# Altium schematic sheet RS422.SchDoc
size 420 x 297 mm; SheetNumber: 25; SheetTotal: 32
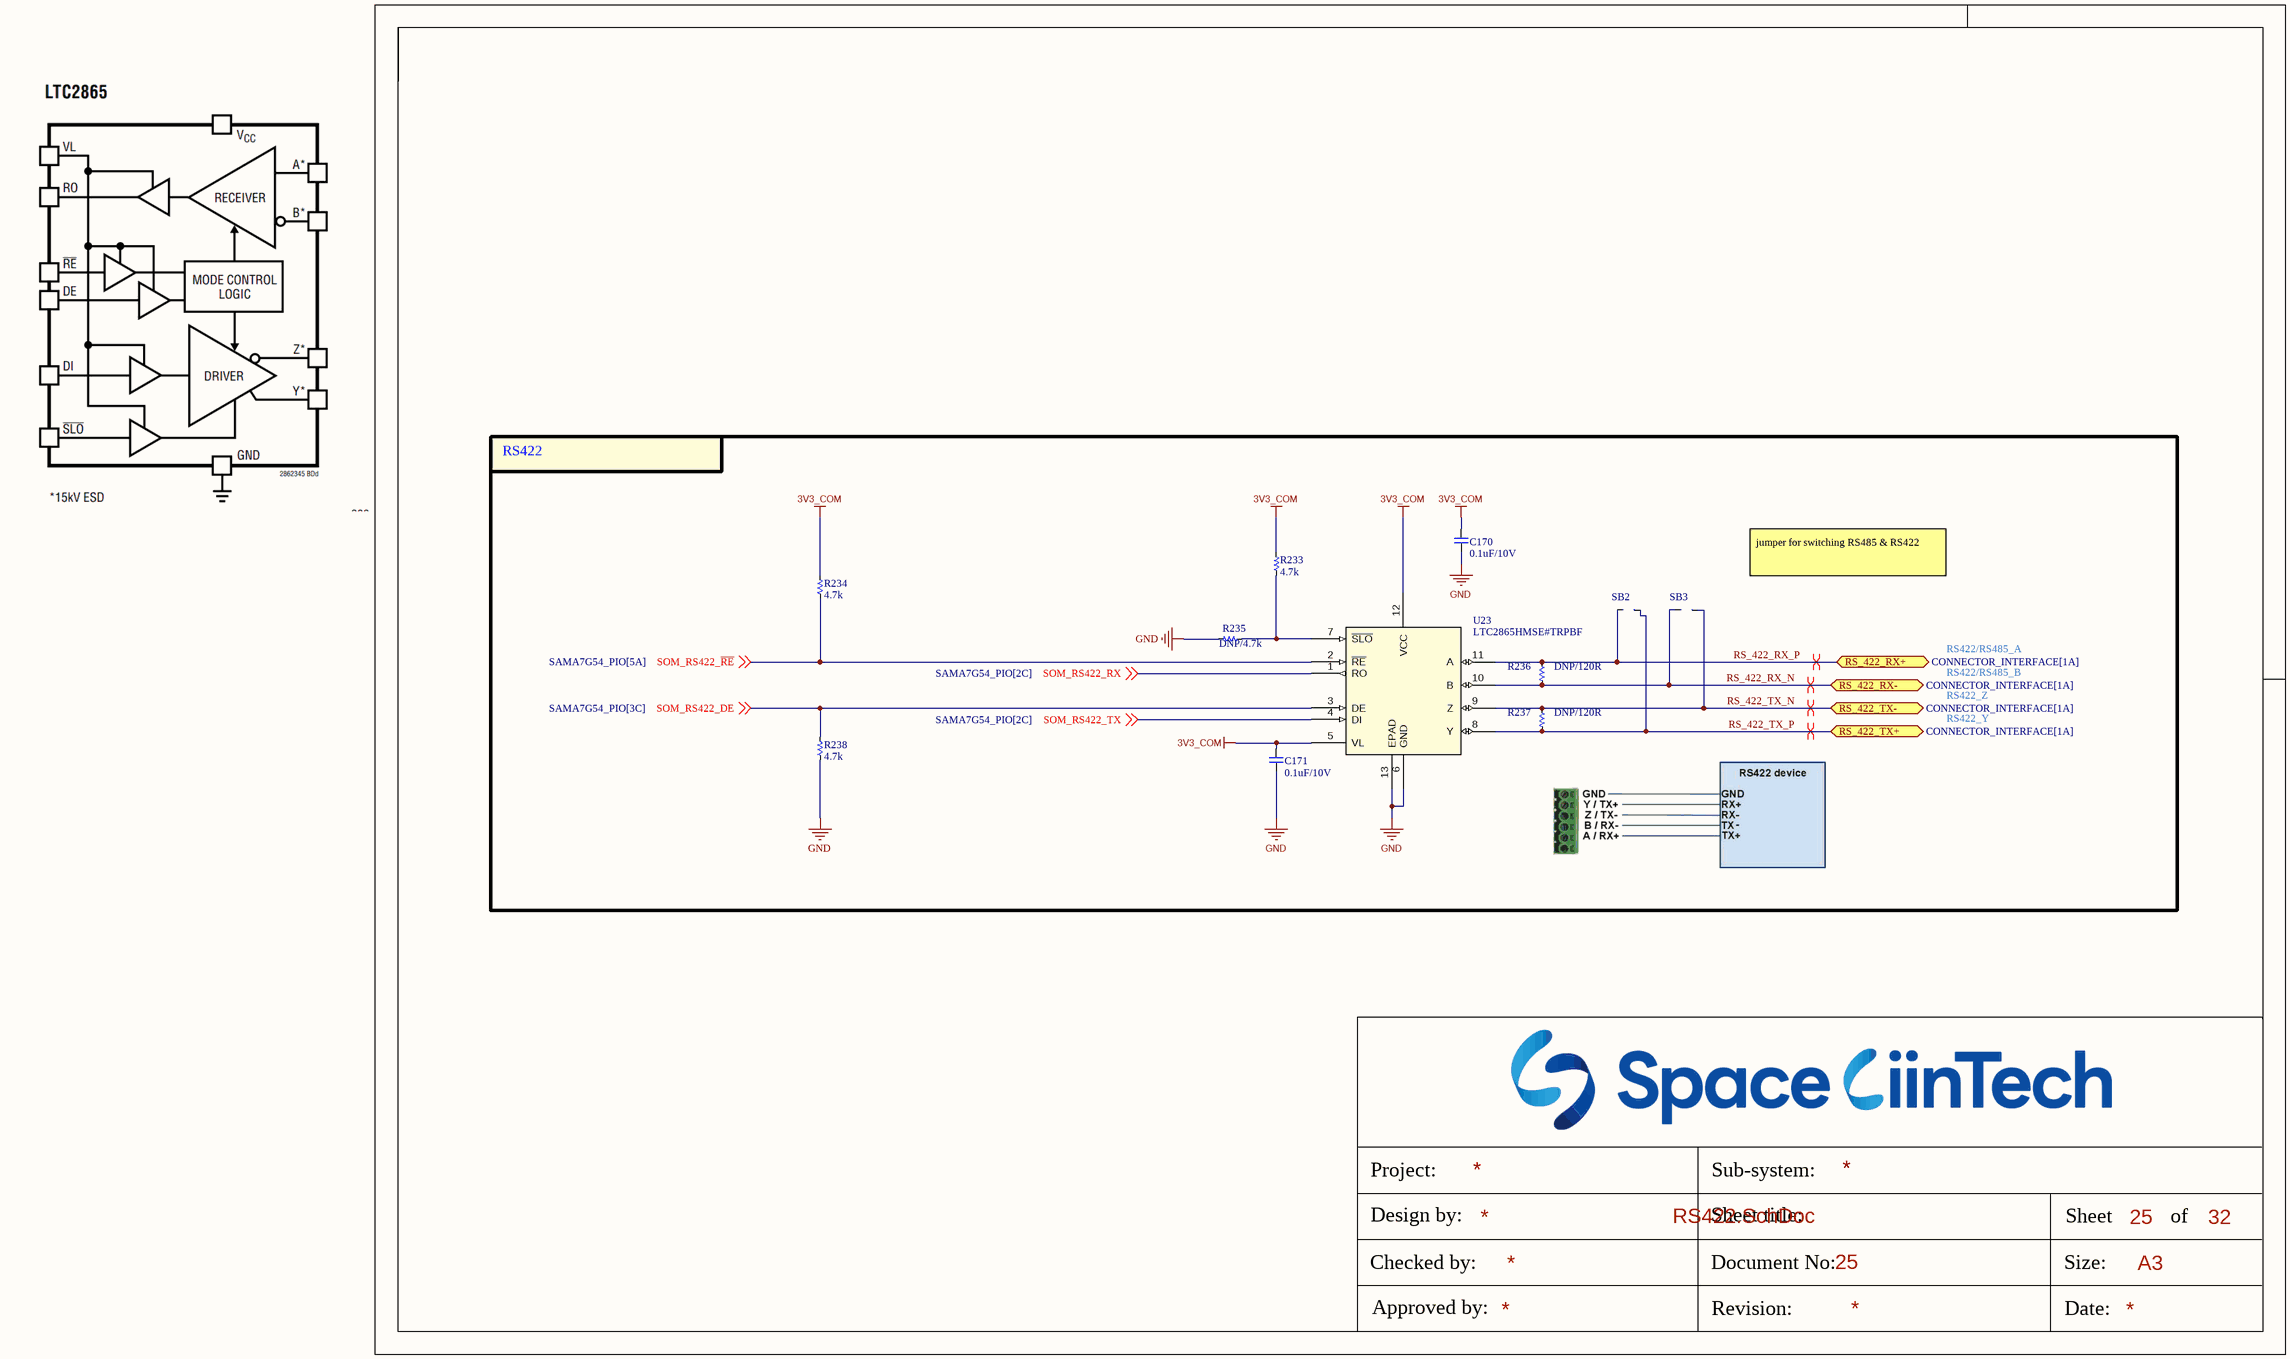
[diagram p0: RS422.SchDoc]

## Parts
C170  0.1uF/10V  [CAP_C_1005X50_L]
C171  0.1uF/10V  [CAP_C_1005X50_L]
R233  4.7k  [RES_C_1005x30_L]
R234  4.7k  [RES_C_1005x30_L]
R235  DNP/4.7k  [RES_C_1005x30_L]
R236  DNP/120R  [RES_C_1005x30_L]
R237  DNP/120R  [RES_C_1005x30_L]
R238  4.7k  [RES_C_1005x30_L]
SB2  JUMPER  [JUMPER_1608]  (value not drawn)
SB3  JUMPER  [JUMPER_1608]  (value not drawn)
U23  LTC2865HMSE#TRPBF  [MSOP-12_MSE_LIT]

## Ports
RS_422_RX+ (bidir, see CONNECTOR_INTERFACE[1A]), RS_422_RX- (bidir, see CONNECTOR_INTERFACE[1A]), RS_422_TX+ (bidir, see CONNECTOR_INTERFACE[1A]), RS_422_TX- (bidir, see CONNECTOR_INTERFACE[1A])

## Nets
3V3_COM: C170.2 C171.2 R233.2 R234.2 U23.5(VL) U23.12(VCC)
GND: C170.1 C171.1 R235.2 R238.1 U23.6(GND) U23.13(EPAD)
RS_422_RX_N: R236.2 SB3.1 U23.10(B) ; port RS_422_RX-
RS_422_RX_P: R236.1 SB2.1 U23.11(A) ; port RS_422_RX+
RS_422_TX_N: R237.1 SB3.2 U23.9(Z) ; port RS_422_TX-
RS_422_TX_P: R237.2 SB2.2 U23.8(Y) ; port RS_422_TX+
SOM_RS422_DE: R238.2 U23.3(DE) ; off-sheet SOM_RS422_DE
SOM_RS422_~{RE}: R234.1 U23.2(~{RE}) ; off-sheet SOM_RS422_~{RE}
SOM_RS422_RX: U23.1(RO) ; off-sheet SOM_RS422_RX
SOM_RS422_TX: U23.4(DI) ; off-sheet SOM_RS422_TX
NetR233_1: R233.1 R235.1 U23.7(~{SLO})

## Layout directives
differential pair: RS_422_RX_N, RS_422_RX_P, RS_422_TX_N, RS_422_TX_P

## Notes on the sheet
- RS422
- jumper for switching RS485 & RS422
- RS422/RS485_A
- RS422/RS485_B
- RS422_Z
- RS422_Y
- Project:
- Sub-system:
- Design by:
- Sheet title:
- Sheet
- A3
- of
- Checked by:
- Approved by:
- Revision:
- Document No:
- Size:
- Date:

## Library data of the parts
C170 C171 = _CAP_C_2: CAP
R233-R238 = _RES_B_2: RES
U23 = LTC2865HMSETRPBF: Â±60V Fault Protected 3V to 5.5V RS485/RS422 Transceivers; Manufacturer_Name: Analog Devices Inc; Copyright: Copyright (C) 2025 Ultra Librarian. All rights reserved.; Manufacturer_Part_Number: LTC2865HMSE#TRPBF; RefDes: RefDes; Type: Type